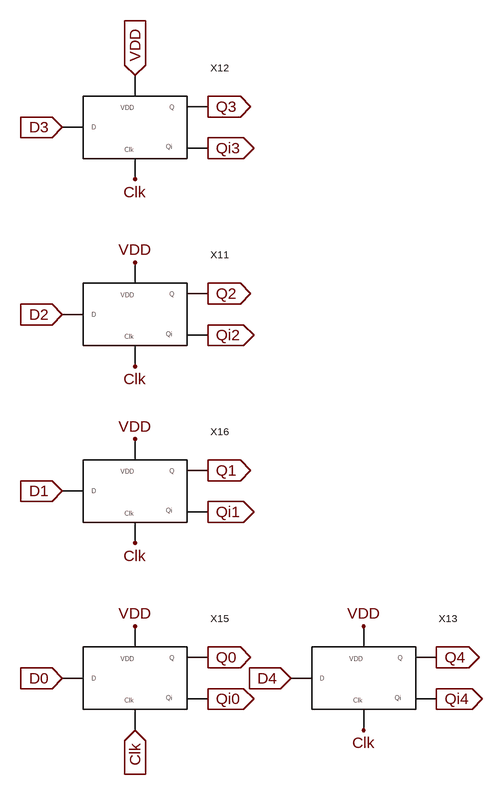
[diagram p0: schematic 5_bit_register.asc]
5_bit_register.asc, the LTspice schematic file:
Version 4
SHEET 1 880 932
FLAG -944 112 VDD
FLAG -944 272 Clk
FLAG -1056 192 D2
IOPIN -1056 192 In
FLAG -832 160 Q2
IOPIN -832 160 Out
FLAG -832 224 Qi2
IOPIN -832 224 Out
FLAG -944 -176 VDD
IOPIN -944 -176 In
FLAG -944 -16 Clk
FLAG -1056 -96 D3
IOPIN -1056 -96 In
FLAG -832 -128 Q3
IOPIN -832 -128 Out
FLAG -832 -64 Qi3
IOPIN -832 -64 Out
FLAG -592 672 VDD
FLAG -592 832 Clk
FLAG -704 752 D4
IOPIN -704 752 In
FLAG -480 720 Q4
IOPIN -480 720 Out
FLAG -480 784 Qi4
IOPIN -480 784 Out
FLAG -944 672 VDD
FLAG -944 832 Clk
IOPIN -944 832 In
FLAG -1056 752 D0
IOPIN -1056 752 In
FLAG -832 720 Q0
IOPIN -832 720 Out
FLAG -832 784 Qi0
IOPIN -832 784 Out
FLAG -944 384 VDD
FLAG -944 544 Clk
FLAG -1056 464 D1
IOPIN -1056 464 In
FLAG -832 432 Q1
IOPIN -832 432 Out
FLAG -832 496 Qi1
IOPIN -832 496 Out
SYMBOL DFF -1024 240 R0
SYMATTR InstName X11
SYMBOL DFF -1024 -48 R0
SYMATTR InstName X12
SYMBOL DFF -672 800 R0
SYMATTR InstName X13
SYMBOL DFF -1024 800 R0
SYMATTR InstName X15
SYMBOL DFF -1024 512 R0
SYMATTR InstName X16

The netlist it stands for:
* 5_bit_register.asc
XX11 D2 Clk Q2 Qi2 VDD DFF  ; pins D Clk Q Qi VDD
XX12 D3 Clk Q3 Qi3 VDD DFF  ; pins D Clk Q Qi VDD
XX13 D4 Clk Q4 Qi4 VDD DFF  ; pins D Clk Q Qi VDD
XX15 D0 Clk Q0 Qi0 VDD DFF  ; pins D Clk Q Qi VDD
XX16 D1 Clk Q1 Qi1 VDD DFF  ; pins D Clk Q Qi VDD
.backanno
.end